# EAGLE design MovingHeadV2 (EAGLE 9.0.1)
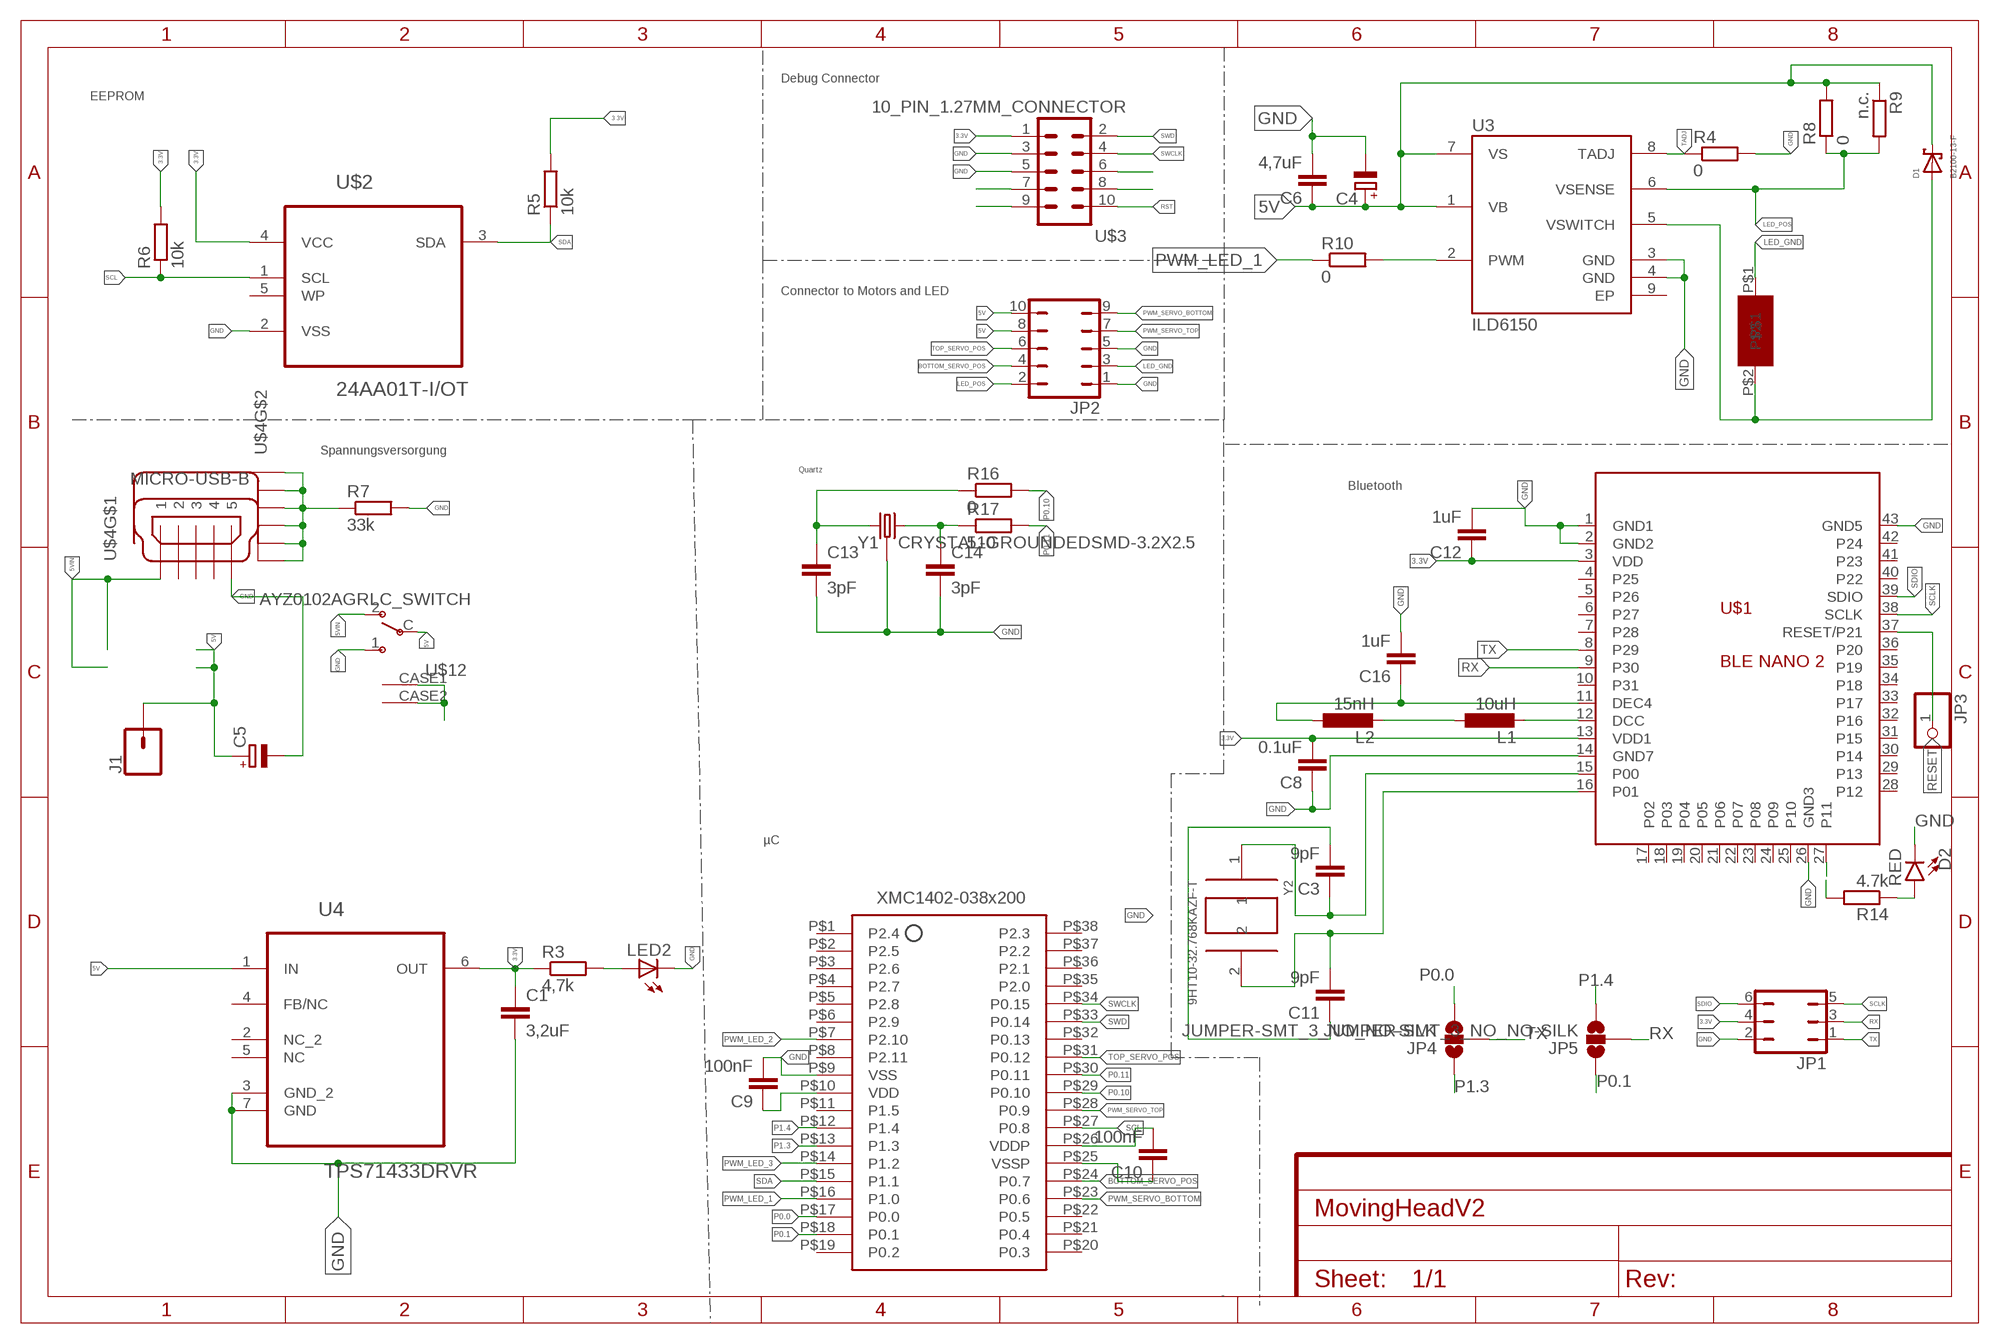
[diagram p0: schematic, sheet 1]

## Parts
C1  3,2uF  C-EUC0805  [C0805]
C3  9pF  C-EUC0805  [C0805]
C4  CPOL-EUD  [PANASONIC_D]
C5  CPOL-EUB/3528-21R  [B/3528-21R]
C6  4,7uF  C-EUC0805  [C0805]
C8  0.1uF  C-EUC0805  [C0805]
C9  100nF  C-EUC0805  [C0805]
C10  100nF  C-EUC0805  [C0805]
C11  9pF  C-EUC0805  [C0805]
C12  1uF  C-EUC0603  [C0603]
C13  3pF  C-EUC0805  [C0805]
C14  3pF  C-EUC0805  [C0805]
C16  1uF  C-EUC0603  [C0603]
D1  B2100-13-F  B220  [SMB]
D2  RED  LED-RED0603  [LED-0603]
J1  CONN_01  [1X01]
JP1  JP3Q  [JP3Q]
JP2  JP5Q  [JP5Q]
JP3  PINHD-1X1  [1X01]
JP4  JUMPER-SMT_3_NO_NO-SILK  [SMT-JUMPER_3_NO_NO-SILK]
JP5  JUMPER-SMT_3_NO_NO-SILK  [SMT-JUMPER_3_NO_NO-SILK]
L1  10uH  L-EUL2012C  [L2012C]
L2  15nH  L-EUL2012C  [L2012C]
LED2  LEDCHIPLED_0805  [CHIPLED_0805]
R3  4,7k  R-EU_R0805  [R0805]
R4  0  R-EU_R0805  [R0805]
R5  10k  R-EU_R0805  [R0805]
R6  10k  R-EU_R0805  [R0805]
R7  33k  R-EU_R0805  [R0805]
R8  0  R-EU_R0805  [R0805]
R9  n.c.  R-EU_R0805  [R0805]
R10  0  R-EU_R0805  [R0805]
R14  4.7k  R-EU_R0805  [R0805]
R16  0  R-EU_R0805  [R0805]
R17  510  R-EU_R0805  [R0805]
U3  ILD6150  [SOIC127P600X170-9N-V2]
U4  TPS71433DRVR  [SON65P200X200X80-7N]
U$1  BLE NANO 2  RBT07  [RBT07]
U$2  24AA01T-I/OT  [SOT95P270X145-5N]
U$3  10_PIN_1.27MM_CONNECTOR  [10_PIN_1.27MM]
U$4  MICRO-USB-B  [MICRO_USB_B]
U$7  CUSTOMCOIL6.8UH  [CUSTOMCOIL6.8UH]
U$10  XMC1400_38P  [XMC1400_38P]
U$12  AYZ0102AGRLC_SWITCH  [AYZ0102AGRLC]
Y1  CRYSTAL-GROUNDEDSMD-3.2X2.5  [CRYSTAL-SMD-3.2X2.5MM]
Y2  9HT10-32.768KAZF-T  [XTAL320X150X75]

## Nets
3.3V: C1.1 C8.2 C9.1 C10.2 C12.1 JP1.4 R3.1 R5.2 R6.2 U4.6(OUT) U$1.3(VDD) U$1.13(VDD1) U$2.4(VCC) U$3.1 U$10.P$10(VDD) U$10.P$26(VDDP)
5V: C4.+ C5.+ C6.1 D1.C J1.1 JP2.8 JP2.10 R8.2 R9.1 U3.1(VB) U3.7(VS) U4.1(IN) U$12.C
5VIN: U$4.1 U$12.2
BOTTOM_SERVO_POS: JP2.4 U$10.P$24(P0.7)
GND: C1.2 C3.2 C4.- C5.- C6.2 C8.1 C9.2 C10.1 C11.1 C12.2 C13.2 C14.2 C16.2 D2.C JP1.2 JP2.1 JP2.5 LED2.C R4.2 R7.2 U3.3(GND) U3.4(GND) U4.3(GND_2) U4.7(GND) U$1.1(GND1) U$1.2(GND2) U$1.14(GND7) U$1.26(GND3) U$1.43(GND5) U$2.2(VSS) U$3.3 U$3.5 U$4.5 U$10.P$9(VSS) U$10.P$25(VSSP) U$12.1 U$12.CASE1 U$12.CASE2 Y1.2 Y1.4
LED_GND: JP2.3 U$7.P$1
LED_POS: JP2.2 R8.1 R9.2 U3.6(VSENSE)
N$1: R10.2 U3.2(PWM)
N$2: D2.A R14.1
N$4: LED2.A R3.2
N$6: R7.1 U$4.P$1(S1) U$4.P$2(S2) U$4.P$6(S3) U$4.P$7(S4) U$4.P$9(S5) U$4.P$10(S6)
N$9: U$3.7
N$10: D1.A U3.5(VSWITCH) U$7.P$2
N$11: U$3.9
N$13: U$3.8
N$14: U$3.6
N$29: C14.1 R17.1 Y1.3
N$30: C13.1 R16.1 Y1.1
N$36: L1.2 U$1.12(DCC)
N$38: L1.1 L2.2
N$39: C16.1 L2.1 U$1.11(DEC4)
N$70: C3.1 U$1.15(P00) Y2.1
N$71: C11.2 U$1.16(P01) Y2.2
N$75: R14.2 U$1.27(P11)
P0.0: JP4.3 U$10.P$17(P0.0)
P0.1: JP5.1 U$10.P$18(P0.1)
P0.10: R16.2 U$10.P$29(P0.10)
P0.11: R17.2 U$10.P$30(P0.11)
P1.3: JP4.1 U$10.P$13(P1.3)
P1.4: JP5.3 U$10.P$12(P1.4)
PWM_LED_1: R10.1 U$10.P$16(P1.0)
PWM_LED_2: U$10.P$7(P2.10)
PWM_LED_3: U$10.P$14(P1.2)
PWM_SERVO_BOTTOM: JP2.9 U$10.P$23(P0.6)
PWM_SERVO_TOP: JP2.7 U$10.P$28(P0.9)
RESET: JP3.1 U$1.37(RESET/P21)
RST: U$3.10
RX: JP1.3 JP5.2 U$1.9(P30)
SCL: R6.1 U$2.1(SCL) U$10.P$27(P0.8)
SCLK: JP1.5 U$1.38(SCLK)
SDA: R5.1 U$2.3(SDA) U$10.P$15(P1.1)
SDIO: JP1.6 U$1.39(SDIO)
SWCLK: U$3.4 U$10.P$34(P0.15)
SWD: U$3.2 U$10.P$33(P0.14)
TADJ: R4.1 U3.8(TADJ)
TOP_SERVO_POS: JP2.6 U$10.P$31(P0.12)
TX: JP1.1 JP4.2 U$1.8(P29)
Unconnected: U4.2(NC_2) U4.4(FB/NC) U4.5(NC) U$1.4(P25) U$1.5(P26) U$1.6(P27) U$1.7(P28) U$1.10(P31) U$1.17(P02) U$1.18(P03) U$1.19(P04) U$1.20(P05) U$1.21(P06) U$1.22(P07) U$1.23(P08) U$1.24(P09) U$1.25(P10) U$1.28(P12) U$1.29(P13) U$1.30(P14) U$1.31(P15) U$1.32(P16) U$1.33(P17) U$1.34(P18) U$1.35(P19) U$1.36(P20) U$1.40(P22) U$1.41(P23) U$1.42(P24) U$2.5(WP) U$4.2 U$4.3 U$4.4 U$10.P$1(P2.4) U$10.P$2(P2.5) U$10.P$3(P2.6) U$10.P$4(P2.7) U$10.P$5(P2.8) U$10.P$6(P2.9) U$10.P$8(P2.11) U$10.P$11(P1.5) U$10.P$19(P0.2) U$10.P$20(P0.3) U$10.P$21(P0.4) U$10.P$22(P0.5) U$10.P$32(P0.13) U$10.P$35(P2.0) U$10.P$36(P2.1) U$10.P$37(P2.2) U$10.P$38(P2.3)

## Notes on the sheet
- Debug Connector
- EEPROM
- Connector to Motors and LED
- Spannungsversorgung
- Quartz
- Bluetooth
- µC

## Power pins joined to a net without a drawn wire
EP: U3.9(EP)

## Library data of the parts
C1 C6 C9 C10 = rcl:C-EU: CAPACITOR, European symbol; SPICEPREFIX: C
C3 C8 C11-C14 C16 = rcl:C-EU: CAPACITOR, European symbol
C4 C5 = rcl:CPOL-EU: POLARIZED CAPACITOR, European symbol; SPICEPREFIX: C
D1 = Schottky:B2*: Schottky Diode; DISTRIBUTOR: Diverse; DISTRIBUTOR_PART_NUMBER: *; MANUFACTURER_1: Diodes; MANUFACTURER_1_PART_NUMBER: B220-13-F; MANUFACTURER_2: Diverse; MANUFACTURER_2_PART_NUMBER: Diverse; MANUFACTURER_3: Diverse; MANUFACTURER_3_PART_NUMBER: Diverse; PACKAGE: *; PARTTYPE: *; PRICE_1K: *; PRICE_SAMPLE: *; SMD_PTH: SMD; SPANNUNG_STROM: 20V/2A; TOLERANCE: *
D2 = SparkFun-LED:LED-RED: Red SMD LED Used in manufacturing of most products at SparkFun Packages: 0603 - SMD 0603 package [Product Link] <http://docs.avagotech.com/docs/AV02-0551EN> 0603 SMART - SMD 0603 SMART package ( more efficient and expensive)[Product Link] <http://www.osram-os.com/Graphics/XPic2/00077099_0.pdf> 1206 - SMD1206 package [Product Link] <https://www.sparkfun.com/datasheets/DevTools/LilyPad/Q150OVS4.pdff> SparkFun Products: Pro Mini 328 -5V <https://www.sparkfun.com/products/821> RedBoard <https://www.sparkfun.com/products/12757> IOIO-OTG <https://www.sparkfun.com/products/13613>; PROD_ID: DIO-00819
J1 = SparkFun-Connectors:CONN_01: Single connection point. Often used as Generic Header-pin footprint for 0.1 inch spaced/style header connections On any of the 0.1 inch spaced packages, you can populate with these: Break Away Headers - Straight <https://www.sparkfun.com/products/116> (PRT-00116) Break Away Male Headers - Right Angle <https://www.sparkfun.com/products/553> (PRT-00553) Female Headers <https://www.sparkfun.com/products/115> (PRT-00115) Break Away Headers - Machine Pin <https://www.sparkfun.com/products/117> (PRT-00117) Break Away Female Headers - Swiss Machine Pin <https://www.sparkfun.com/products/743> (PRT-00743) This device is also useful as a general connection point to wire up your design to another part of your project. Our various solder wires solder well into these plated through hole pads. Hook-Up Wire - Assortment (Stranded, 22 AWG) <https://www.sparkfun.com/products/11375> (PRT-11375) Hook-Up Wire - Assortment (Solid Core, 22 AWG) <https://www.sparkfun.com/products/11367> (PRT-11367) View the entire wire category on our website here <https://www.sparkfun.com/categories/141> Special notes: SMTSO-256-ET is a "flush mount" nut for a 4-40 screw. We mostly use this on specialty testbeds; it is a nice way to connect hardware to your PCB at an adjustable hieght. Also note, the SNAP packages are for using a snappable style connector. We sell a baggie of snaps and they are also used on two LilyPad designs: Snap Assortment - 30 pack (male and female) <https://www.sparkfun.com/products/11347> (DEV-11347) LilyPad Arduino SimpleSnap <https://www.sparkfun.com/products/10941> (DEV-10941) LilyPad SimpleSnap Protoboard <https://www.sparkfun.com/products/10940> (DEV-10940)
JP1 = jumper:JP3Q: JUMPER
JP2 = jumper:JP5Q: JUMPER
JP3 = pinhead:PINHD-1X1: PIN HEADER
JP4 JP5 = SparkFun-Jumpers:JUMPER-SMT_3_NO: Normally open jumper This jumper has three pads in close proximity to each other. Apply solder to close the connection(s).
L1 L2 = rcl:L-EU: INDUCTOR, European symbol
LED2 = led:LED: LED OSRAM: - CHIPLED LG R971, LG N971, LY N971, LG Q971, LY Q971, LO R971, LY R971 LH N974, LH R974 LS Q976, LO Q976, LY Q976 LO Q996 - Hyper CHIPLED LW Q18S LB Q993, LB Q99A, LB R99A - SideLED LS A670, LO A670, LY A670, LG A670, LP A670 LB A673, LV A673, LT A673, LW A673 LH A674 LY A675 LS A676, LA A676, LO A676, LY A676, LW A676 LS A679, LY A679, LG A679 - Hyper Micro SIDELED® LS Y876, LA Y876, LO Y876, LY Y876 LT Y87S - SmartLED LW L88C, LW L88S LB L89C, LB L89S, LG L890 LS L89K, LO L89K, LY L89K LS L896, LA L896, LO L896, LY L896 - TOPLED LS T670, LO T670, LY T670, LG T670, LP T670 LSG T670, LSP T670, LSY T670, LOP T670, LYG T670 LG T671, LOG T671, LSG T671 LB T673, LV T673, LT T673, LW T673 LH T674 LS T676, LA T676, LO T676, LY T676, LB T676, LH T676, LSB T676, LW T676 LB T67C, LV T67C, LT T67C, LS T67K, LO T67K, LY T67K, LW E67C LS E67B, LA E67B, LO E67B, LY E67B, LB E67C, LV E67C, LT E67C LW T67C LS T679, LY T679, LG T679 LS T770, LO T770, LY T770, LG T770, LP T770 LB T773, LV T773, LT T773, LW T773 LH T774 LS E675, LA E675, LY E675, LS T675 LS T776, LA T776, LO T776, LY T776, LB T776 LHGB T686 LT T68C, LB T68C - Hyper Mini TOPLED® LB M676 - Mini TOPLED Santana® LG M470 LS M47K, LO M47K, LY M47K Source: http://www.osram.convergy.de LUXEON: - LUMILED® LXK2-PW12-R00, LXK2-PW12-S00, LXK2-PW14-U00, LXK2-PW14-V00 LXK2-PM12-R00, LXK2-PM12-S00, LXK2-PM14-U00 LXK2-PE12-Q00, LXK2-PE12-R00, LXK2-PE12-S00, LXK2-PE14-T00, LXK2-PE14-U00 LXK2-PB12-K00, LXK2-PB12-L00, LXK2-PB12-M00, LXK2-PB14-N00, LXK2-PB14-P00, LXK2-PB14-Q00 LXK2-PR12-L00, LXK2-PR12-M00, LXK2-PR14-Q00, LXK2-PR14-R00 LXK2-PD12-Q00, LXK2-PD12-R00, LXK2-PD12-S00 LXK2-PH12-R00, LXK2-PH12-S00 LXK2-PL12-P00, LXK2-PL12-Q00, LXK2-PL12-R00 Source: www.luxeon.com KINGBRIGHT: KA-3528ASYC Source: www.kingbright.com
R3-R10 = rcl:R-EU_: RESISTOR, European symbol; SPICEPREFIX: R
R14 R16 R17 = rcl:R-EU_: RESISTOR, European symbol
U3 = 1_MynewBib:ILD6150: ILD6150 LED Driver IC for High Power LEDs, 60V/1.5A High Efficiency Step-Down LED Driver IC SOIC127P600X170-9N-V2
U4 = 1_MynewBib:TPS71433DRVR: LOW-DROPOUT LINEAR REGULATOR; AVAILABILITY: Good; DESCRIPTION: 80mA, 10V, Quiescent Current 3.0?A, LDO Linear Regulator in SC70 or SON2x2 6-WSON -40 to 125; MF: Texas Instruments; MP: TPS71433DRVR; PACKAGE: SON-6 Texas Instruments; PRICE: 0.41 USD
U$1 = 1RedBeard:RBT07
U$2 = Microchip_By_element14_Batch_1:24AA01T-I/OT: EEPROM; DESCRIPTION: Serial EEPROM; MPN: 24AA01T-I/OT; OC_FARNELL: 1331269; OC_NEWARK: 72C4376; PACKAGE: SOT-5; SUPPLIER: Microchip
U$3 = own-connectors:10_PIN_1.27MM_CONNECTOR: Board-toBoard-Steckverbinder, 1.27MM Rastermaß Hersteller: Amphenol z.B.: Modell 20021111-00010T4LF von FCI
U$4 = own-connectors:MICRO-USB-B: Molex Micro Usb TYP-B Buchse, 5polig Produkt: MOLEX 105017-0001, Farnell Link: http://www.molex.com/molex/products/datasheet.jsp?part=active/1050170001_IO_CONNECTORS.xml&channel=Products&Lang=en-US
U$7 = 1_MynewBib:CUSTOMCOIL6.8UH
U$10 = 1_MynewBib:XMC1400_38P
U$12 = own-poti-switches:AYZ0102AGRLC_SWITCH: AYZ0102AGLC SPDT Switch On-On, Small, 100mA, 12V Supplier: C&K Components Sale: Farnell
Y1 = SparkFun-Clocks:CRYSTAL-GROUNDED: Crystals w/ Ground Pin (Generic) These are passive quartz crystals, which can be used as a clock source for a microcontroller. Crystal's are usually two-terminal devices. A third terminal may be optionally connected to ground, as recommended by the manufaturer.
Y2 = 9HT10-32.768KAZF-T:9HT10-32.768KAZF-T: Crystal, 32.768khz, 12.5pf, 3.2 x 1.5mm

## Board
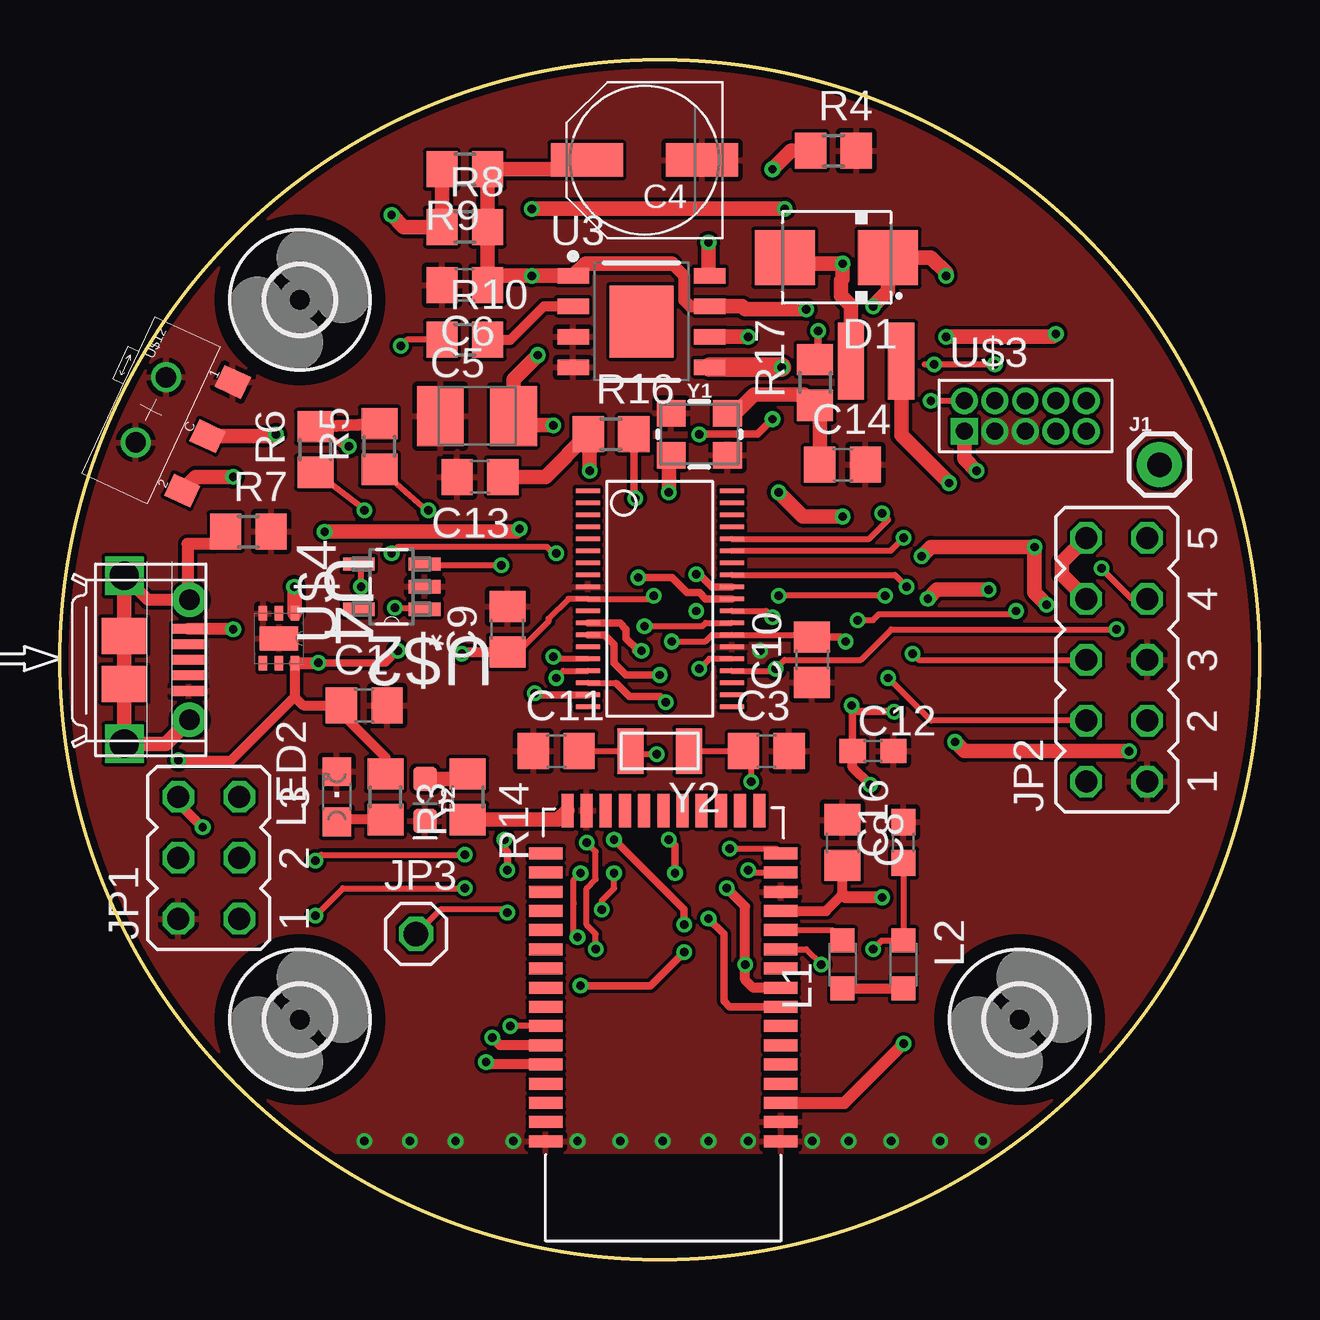
[diagram p1: board, top side]
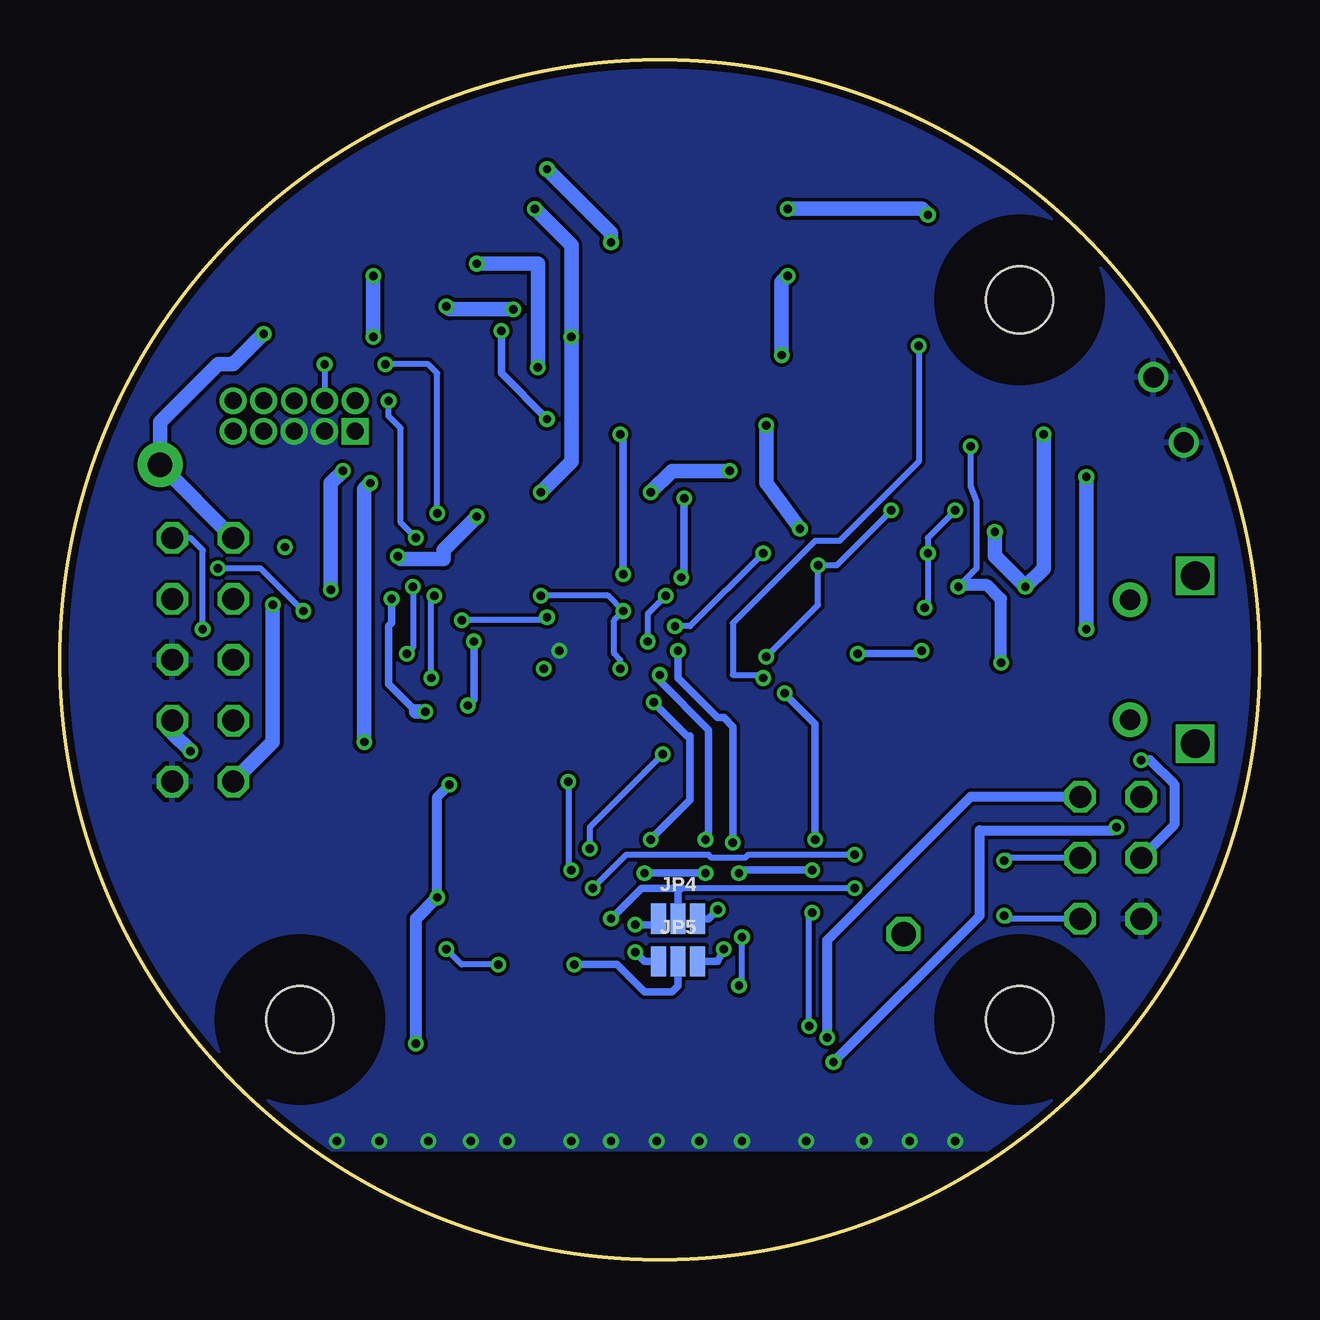
[diagram p2: board, bottom side, seen from below]

Size 50 x 50 mm. Coordinates in mm from the lower left corner, seen from the top.
Outline: circle at 25,25 radius 25
Copper layers (1*16): Top 0.035mm / dielectric 1.5mm / Bottom 0.035mm
Design rules "PCB-POOL Standard *": minimum track width 0.15mm, minimum drill 0.3mm, track to track 0.15mm, track to pad 0.15mm, pad to pad 0.15mm, via to via 0.15mm, smd to smd 0.15mm, copper to edge 0.3mm, drill to drill 0.2mm, minimum pad ring 0.2mm, minimum via ring 0.15mm, stop-mask expansion 0.075mm, vias tented up to drill 0.35mm, thermal gap 0.2mm
tRestrict: area 10.8,-6.5 to 39.5,4.2
bRestrict: area 10.5,-6.5 to 39.2,4.3

### Footprints (pad centres in the part's own frame; a part is rotated, then mirrored left to right if it is on the bottom)
C0805 = smd 1.3 x 1.5: 1 -0.95,0; 2 0.95,0
PANASONIC_D = smd 3 x 1.4: + 2.4,0; - -2.4,0
B/3528-21R = smd 1.95 x 2.5: + 1.525,0; - -1.525,0
C0603 = smd 1.1 x 1: 1 -0.85,0; 2 0.85,0
SMB = smd 2.5 x 2.3: A 2.15,0; C -2.15,0
LED-0603 = smd 1 x 1: A -0.877,0; C 0.877,0
1X01 = drill 1.016 pad 1.88: 1 0,0
JP3Q = drill 0.914 octagon: 1 -2.54,-1.27; 2 -2.54,1.27; 3 0,-1.27; 4 0,1.27; 5 2.54,-1.27; 6 2.54,1.27
JP5Q = drill 0.914 octagon: 1 -5.08,-1.27; 2 -5.08,1.27; 3 -2.54,-1.27; 4 -2.54,1.27; 5 0,-1.27; 6 0,1.27; 7 2.54,-1.27; 8 2.54,1.27; 9 5.08,-1.27; 10 5.08,1.27
1X01' = drill 1.016 octagon: 1 0,0
SMT-JUMPER_3_NO_NO-SILK = smd 0.635 x 1.27: 1 -0.813,0; 2 0,0; 3 0.813,0
L2012C = smd 1 x 1: 1 -1,0; 2 1,0
CHIPLED_0805 = smd 1.2 x 1.2: A 0,-1.05; C 0,1.05
R0805 = smd 1.3 x 1.5: 1 -0.95,0; 2 0.95,0
SOIC127P600X170-9N-V2 = smd 1.31 x 0.65: 1 -2.845,1.905; 2 -2.845,0.635; 3 -2.845,-0.635; 4 -2.845,-1.905; 5 2.845,-1.905; 6 2.845,-0.635; 7 2.845,0.635; 8 2.845,1.905 | smd 2.65 x 3: 9 0,0
SON65P200X200X80-7N = smd 0.61 x 0.356: 1 -1.041,0.66; 2 -1.041,0; 3 -1.041,-0.66; 4 1.041,-0.66; 5 1.041,0; 6 1.041,0.66 | smd 0.991 x 1.6: 7 0,0
RBT07 = smd 1.4 x 0.5: 1 -0.649,13.085; 2 -0.649,12.285; 3 -0.649,11.485; 4 -0.649,10.685; 5 -0.649,9.885; 6 -0.649,9.085; 7 -0.649,8.285; 8 -0.649,7.485; 9 -0.649,6.685; 10 -0.649,5.885; 11 -0.649,5.085; 12 -0.649,4.285; 13 -0.649,3.485; 14 -0.649,2.685; 15 -0.649,1.885; 16 -0.649,1.085; 28 9.151,1.085; 29 9.151,1.885; 30 9.151,2.685; 31 9.151,3.485; 32 9.151,4.285; 33 9.151,5.085; 34 9.151,5.885; 35 9.151,6.685; 36 9.151,7.485; 37 9.151,8.285; 38 9.151,9.085; 39 9.151,9.885; 40 9.151,10.685; 41 9.151,11.485; 42 9.151,12.285; 43 9.151,13.085 | smd 0.5 x 1.4: 17 0.251,-0.7; 18 1.051,-0.7; 19 1.851,-0.7; 20 2.651,-0.7; 21 3.451,-0.7; 22 4.251,-0.7; 23 5.051,-0.7; 24 5.851,-0.7; 25 6.651,-0.7; 26 7.451,-0.7; 27 8.251,-0.7
SOT95P270X145-5N = smd 1.321 x 0.559: 1 -1.372,0.94; 2 -1.372,0; 3 -1.372,-0.94; 4 1.372,-0.94; 5 1.372,0.94
10_PIN_1.27MM = drill 0.71 pad 0.889 square: 1 -2.54,-0.635 | drill 0.71 pad 0.889: 2 -2.54,0.635; 3 -1.27,-0.635; 4 -1.27,0.635; 5 0,-0.635; 7 1.27,-0.635; 8 1.27,0.635; 9 2.54,-0.635; 10 2.54,0.635 | drill 0.7 pad 0.889: 6 0,0.635
MICRO_USB_B = smd 1.35 x 0.4: 1 0.68,1.3; 2 0.68,0.65; 3 0.68,0; 4 0.68,-0.65; 5 0.68,-1.3 | drill 1.2 pad 1.5 square: P$1 -2,3.5; P$2 -2,-3.5 | smd 1.9 x 1.5: P$6 -2,-1; P$7 -2,1 | drill 0.85 pad 1.45: P$9 0.72,2.5; P$10 0.72,-2.5
2,8 = hole 2.8: 0,0
CUSTOMCOIL6.8UH = smd 1.1 x 3.2: P$1 -1.05,0; P$2 1.05,0
XMC1400_38P = smd 1 x 0.2: P$1 -3,4.5; P$2 -3,4; P$3 -3,3.5; P$4 -3,3; P$5 -3,2.5; P$6 -3,2; P$7 -3,1.5; P$8 -3,1; P$9 -3,0.5; P$10 -3,0; P$11 -3,-0.5; P$12 -3,-1; P$13 -3,-1.5; P$14 -3,-2; P$15 -3,-2.5; P$16 -3,-3; P$17 -3,-3.5; P$18 -3,-4; P$19 -3,-4.5; P$20 3,-4.5; P$21 3,-4; P$22 3,-3.5; P$23 3,-3; P$24 3,-2.5; P$25 3,-2; P$26 3,-1.5; P$27 3,-1; P$28 3,-0.5; P$29 3,0; P$30 3,0.5; P$31 3,1; P$32 3,1.5; P$33 3,2; P$34 3,2.5; P$35 3,3; P$36 3,3.5; P$37 3,4; P$38 3,4.5
AYZ0102AGRLC = smd 1 x 1.2: 1 -2.5,2.6; 2 2.5,2.6; C 0,2.6 | drill 0.85 pad 1: CASE1 -1.5,0; CASE2 1.5,0
CRYSTAL-SMD-3.2X2.5MM = smd 1.2 x 1.1: 1 -1.175,-0.875; 2 1.175,-0.875; 3 1.175,0.875; 4 -1.175,0.875
XTAL320X150X75 = smd 1.092 x 1.905: 1 -1.219,0; 2 1.219,0

### Placement (x,y rotation side)
C1  12.68,23.09 0 top
C3  29.45,21.19 0 top
C4  24.36,45.83 180 top
C5  17.38,35.16 0 top
C6  16.87,40.62 180 top
C8  32.62,17.38 270 top
C9  18.65,26.27 90 top
C10  31.35,25 90 top
C11  20.68,21.19 0 top
C12  33.89,21.19 0 top
C13  17.51,32.62 180 top
C14  32.62,33.13 0 top
C16  35.16,17.38 90 top
D1  32.37,41.76 180 top
D2  15.22,19.16 270 top
J1  45.83,33.13 0 top
JP1  6.2,16.74 90 top
JP2  44.05,25 90 top
JP3  [1X01']  14.84,13.57 0 top
JP4  24.24,14.21 0 bottom
JP5  24.24,12.43 0 bottom
L1  32.62,12.3 90 top
L2  35.16,12.3 270 top
LED2  11.54,19.29 0 top
R3  13.57,19.29 270 top
R4  32.24,46.21 0 top
R5  13.32,33.89 90 top
R6  10.65,33.76 90 top
R7  7.86,30.33 0 top
R8  16.87,43.03 0 top
R9  16.87,45.45 180 top
R10  16.87,38.34 0 top
R14  17,19.29 270 top
R16  22.97,34.4 0 top
R17  31.48,36.56 90 top
U3  24.24,39.1 0 top
U4  9.12,25.89 270 top
U$1  29.4,18.02 180 top
U$2  13.82,28.05 180 top
U$3  40.24,35.16 0 top
U$4  4.68,25 0 top
U$5  [2,8]  10,40 0 top
U$6  [2,8]  40,10 0 top
U$7  34.02,37.45 180 top
U$8  [2,8]  10,10 0 top
U$10  25,27.54 0 top
U$12  3.79,35.41 245 top
Y1  26.65,34.4 0 top
Y2  25,21.19 180 top

### Tracks (layer width: path | path; a pad name or v marks a point on that pad's centre or on a via)
3.3V  (via drill 0.35)
  Top 0.254: 19.1,25.32 20.36,26.59 20.36,26.71 21.19,27.54 U$10.P$10 24.62,27.54 v24.75,27.67 | 31.26,26.04 U$10.P$26 27.18,26.04 26.91,25.76 v25.51,25.76 | R6.2 11.85,33.89 v12.05,33.89 | v12.55,28.05 12.55,28.89 U$2.4
  Top 0.305: v34.78,22.84 33.26,22.84 v33,23.09 | v32.75,25.76 32.56,25.95 C10.2 | C12.1 33.04,23.06 | v10.78,24.87 13.57,24.87 v14.08,25.38
  Top 0.406: U4.6 9.79,23.45 | 11.41,23.09 10.14,23.09 9.79,23.45 | 11.41,23.09 C1.1 | 19.1,25.32 C9.1 16.81,25.32 v16.74,25.25 | 31.26,26.04 C10.2 | 13.19,20.62 R3.1 13.57,20.94 11.41,23.09 | v4.93,20.81 7.14,20.81 9.79,23.45 | U$1.13 31.93,14.53 32.62,15.22 C8.2 | v33.76,19.79 33.04,20.52 C12.1
  Top 0.508: R6.2 R5.2 | U4.6 9.81,24.87 v10.78,24.87 | 33.04,23.06 v33,23.09 | U$1.3 32.69,6.53 v35.16,9 | v34.27,15.09 32.75,15.09 32.62,15.22
  Top 0.61: U$3.1 37.7,33.38 v38.21,32.87 | v38.72,27.92 36.56,27.92 v36.18,27.54
  Bottom 0.254: v12.05,33.89 12.05,32.24 11.79,31.6 11.79,28.81 12.49,28.11 v12.55,28.05 | v24.75,27.67 25.51,26.91 v25.51,25.76
  Bottom 0.305: v36.18,27.54 36.18,26.52 36.3,26.4 36.3,23.98 35.16,22.84 | v33,23.09 32.75,23.35 v32.75,25.76 | v14.08,25.38 14.21,25.25 v16.74,25.25
  Bottom 0.406: JP1.4 3.54,18.14 3.54,19.79 4.55,20.81 v4.93,20.81 | v34.27,15.09 34.27,19.29 v33.76,19.79
  Bottom 0.508: v10.78,24.87 10.78,27.54 11.35,28.11 12.49,28.11 | v35.16,9 35.16,14.21 v34.27,15.09
  Bottom 0.61: v38.21,32.87 38.72,32.37 v38.72,27.92 | 35.16,22.84 v34.78,22.84
5V  (via drill 0.35)
  Top 0.406: 8.91,34.31 v9,34.4 | v9.76,28.05 9.79,28.02 | 19.03,30.33 v19.16,30.46 | 19.29,34.78 C5.+
  Top 0.508: 25.51,41.51 26.02,41 26.02,39.99 26.27,39.73 U3.7
  Top 0.61: U$12.C 8.91,34.31 | 9.79,28.02 U4.1 | v11.03,30.33 19.03,30.33 | v20.55,34.78 19.29,34.78 | C4.+ 21.58,45.45 R9.1 R8.2 C6.1 18.2,41 v19.67,41 U3.1 21.9,41.51 25.51,41.51 | C5.+ 18.91,36.69 v19.92,37.7 | v36.94,41 36.94,41.13 36.3,41.76 D1.C 34.52,40.36 v33.89,39.73 | v36.94,38.46 41.38,38.46 v41.51,38.59 | JP2.10 41.76,29.06 41.76,28.56 JP2.8 42.14,28.18 | U3.7 28.43,39.73 28.56,39.61 v31.1,39.61
  Bottom 0.61: v9,34.4 9,28.81 v9.76,28.05 11.03,29.32 v11.03,30.33 | v19.16,30.46 20.55,32.37 v20.55,34.78 | v19.92,37.7 19.92,40.75 v19.67,41 | v36.94,41 v36.94,38.46 | v41.51,38.59 42.78,37.32 43.41,37.32 45.83,34.91 J1.1 JP2.10 | v31.1,39.61 33.76,39.61 v33.89,39.73
5VIN  (via drill 0.35)
  Top 0.406: 7.19,26.3 v7.22,26.27
  Top 0.508: U$4.1 7.19,26.3
  Top 0.61: v7.22,32.62 5.66,32.62 U$12.2
  Bottom 0.61: v7.22,26.27 v7.22,32.62
BOTTOM_SERVO_POS  (via drill 0.35)
  Top 0.254: JP2.4 36.3,22.46 v34.52,24.24 | v34.4,27.67 v29.95,27.67 | v26.52,27.04 v26.52,27.03 | U$10.P$24 27.07,25.04 v26.65,24.62
  Bottom 0.254: v34.52,24.24 34.52,27.54 v34.4,27.67 | v29.95,27.67 27.16,27.67 v26.52,27.03 26.91,26.65 26.91,25.25 26.65,25 v26.65,24.62
GND  (via drill 0.35)
  other vias: 29.19,25.38 21.57,4.93 25.13,4.93 23.35,4.93 27.03,4.93 28.68,4.93 31.35,4.93 32.87,4.93 34.65,4.93 36.68,4.93 38.46,4.93 18.9,4.93 16.49,4.93 14.59,4.93 12.68,4.93
  pour Bottom: -4.21,54.21 -4.21,-4.21 56.75,-4.21 56.75,55.48 -4.21,55.48
  pour Top: -2.94,-2.94 -2.94,54.21 55.48,54.21 55.48,-2.94
LED_GND  (via drill 0.35)
  Top 0.61: v44.56,21.19 37.7,21.19 v37.32,21.57 | v37.06,32.37 35.07,34.36 U$7.P$1
  Bottom 0.61: JP2.3 45.32,21.95 v44.56,21.19 | v37.32,21.57 37.32,32.11 v37.06,32.37
LED_POS  (via drill 0.35)
  Top 0.61: R9.2 R8.1 14.33,43.03 v13.82,43.54 | U3.6 v28.68,38.46 | v29.95,31.98 30.97,30.97 v32.62,30.97 | v35.92,29.32 36.3,29.7 v40.62,29.7 40.62,27.79 v41.13,27.29 | v30.21,43.8 v19.67,43.8
  Top 0.813: JP2.2 42.65,19.79
  Bottom 0.61: v29.95,31.98 28.68,33.26 v28.68,38.46 28.68,42.27 v30.21,43.8 | v32.62,30.97 34.02,29.57 34.02,29.19 35.8,29.19 v35.92,29.32 | v41.13,27.29 41.13,21.57 JP2.2 | v19.67,43.8 14.08,43.8 v13.82,43.54
N$1
  Top 0.406: R10.2 18.78,38.34 20.17,39.73 U3.2
N$2
  Top 0.61: D2.A 16.8,20.04 R14.1
N$4
  Top 0.406: R3.2 11.64,18.34 LED2.A
N$6
  Top 0.508: U$4.P$1 3.68,27.5 U$4.P$9 5.32,27.59 5.32,29.83 6.4,29.83 R7.1
  Top 0.61: U$4.P$1 U$4.P$7 U$4.P$6 U$4.P$2 4.4,21.5 U$4.P$10
N$10  (via drill 0.35)
  Top 0.61: D1.A 30.47,41.51 v32.62,41.51 32.62,40.88 32.56,40.81 32.56,40.18 32.97,39.77 U$7.P$2
  Top 0.813: U3.5 v30.08,37.19
  Bottom 0.61: v32.62,41.51 30.08,41.51 v30.08,37.19
N$29
  Top 0.61: C14.1 31.67,35.41 R17.1 31.04,36.05 28.94,36.05 28.16,35.27 Y1.3
N$30  (via drill 0.35)
  Top 0.61: C13.1 20.24,32.62 R16.1 22.08,34.34 v22.08,32.87 | Y1.1 25.38,33.43 v25.38,31.98
  Bottom 0.61: v25.38,31.98 24.49,32.87 v22.08,32.87
N$36
  Top 0.254: U$1.12 32.19,13.73 L1.2
N$38
  Top 0.406: L1.1 L2.2
N$39  (via drill 0.35)
  Top 0.254: U$1.11 31.1,12.93 v31.73,12.3 | v33.89,12.94 34.26,13.3 L2.1 C16.1
  Bottom 0.254: v31.73,12.3 33.26,12.3 v33.89,12.94
N$70  (via drill 0.35)
  Top 0.254: Y2.1 C3.1 28.81,20.88 v28.81,19.92 | v28.68,16.24 28.79,16.13 U$1.15
  Bottom 0.254: v28.81,19.92 28.81,16.36 v28.68,16.24
N$71  (via drill 0.35)
  Top 0.254: C11.2 Y2.2 23.91,21.06 v24.87,21.06 | v27.92,17.13 29.85,17.13 U$1.16
  Bottom 0.254: v24.87,21.06 27.92,18.02 v27.92,17.13
N$75
  Top 0.61: R14.2 20.77,18.34 U$1.27
P0.0  (via drill 0.35)
  Top 0.254: v22.59,14.59 22.59,14.97 23.09,15.47 v23.09,16.11 | U$10.P$17 23.17,24.04 23.22,23.98
  Top 0.305: v25.64,16.11 25.64,17.25 v25.38,17.51 | v25.25,23.22 25,23.48 23.73,23.48 23.22,23.98
  Bottom 0.305: JP4.3 22.97,14.21 v22.59,14.59 | v23.09,16.11 v25.64,16.11 | v25.38,17.51 23.73,19.16 23.73,21.82 23.86,21.82 v25.25,23.22
P0.1  (via drill 0.35)
  Top 0.254: v21.57,13.44 21.41,13.6 21.41,14.84 21.41,14.87 21.41,15.82 v21.7,16.11
  Top 0.305: v26.02,12.81 24.62,11.41 v21.7,11.41 | v19.79,23.6 19.86,23.54 U$10.P$18 | v18.52,17.51 18.52,17.13 18.65,17 v18.65,16.24
  Bottom 0.254: v21.7,11.41 21.57,11.54 v21.57,13.44
  Bottom 0.305: JP5.1 25.64,12.43 v26.02,12.81 | v19.79,23.6 18.52,22.33 v18.52,17.51 | v21.7,16.11 21.57,16.24 v18.65,16.24
P0.10  (via drill 0.35)
  Top 0.305: R16.2 23.92,31.8 v23.98,31.73 | v24.11,28.43 25.51,28.43 26.14,27.79 26.65,27.79 26.91,27.54 U$10.P$29
  Bottom 0.305: v23.98,31.73 23.98,28.56 v24.11,28.43
P0.11  (via drill 0.35)
  Top 0.305: U$10.P$30 27.17,28.04 26.65,28.56 v26.52,28.56 | v26.65,34.4 29.06,34.4 v29.7,35.03 | v31.6,38.72 31.6,37.63 R17.2
  Bottom 0.305: v26.52,28.56 26.52,34.27 v26.65,34.4 | v29.7,35.03 31.6,36.94 v31.6,38.72
P1.3  (via drill 0.35)
  Top 0.305: 22.44,26.04 U$10.P$13 22.69,26.04 23.09,25.64 23.09,24.87 23.6,24.36 v25,24.36 | v23.09,17.51 26.02,14.59 v26.02,13.95
  Bottom 0.305: v25,24.36 25,24.11 22.97,22.08 22.97,17.63 v23.09,17.51 | v26.02,13.95 25.3,13.95 JP4.1
P1.4  (via drill 0.35)
  Top 0.254: v22.33,12.94 22.33,13.57 21.95,13.95 21.95,15.47 22.33,15.86 22.33,17 v21.95,17.38
  Top 0.305: U$10.P$12 22.46,26.54 | 22.46,26.54 22.82,26.54 | 23.98,25.38 24.11,25.38 | 24.11,25.38 v24.24,25.38 | 22.46,26.54 22.48,26.52 23.35,26.52 23.6,26.27 23.6,25.89 24.11,25.38
  Bottom 0.305: JP5.3 22.59,12.43 v22.33,12.94 | v21.95,17.38 21.95,22.21 22.33,22.59 22.59,22.59 24.24,24.24 v24.24,25.38
PWM_LED_1  (via drill 0.35)
  Top 0.254: R10.1 14.46,38.34 v14.21,38.08 | v20.68,24.24 20.98,24.54 U$10.P$16
  Bottom 0.254: v14.21,38.08 14.21,33.26 17.51,29.95 18.52,29.95 21.95,26.52 21.95,24.36 20.81,24.36 v20.68,24.24
PWM_SERVO_BOTTOM  (via drill 0.35)
  Top 0.254: U$10.P$23 29.75,24.54 v29.83,24.62 30.21,25 33.38,25 34.65,26.27 v44.05,26.27
  Bottom 0.254: v44.05,26.27 44.05,29.57 44.56,30.08 JP2.9
PWM_SERVO_TOP  (via drill 0.35)
  Top 0.254: U$10.P$28 29.44,27.04 v29.7,26.78 | v43.41,28.81 44.69,27.54 JP2.7 | v33.26,26.65 33.89,26.65 34.14,26.91 39.73,26.91 v39.86,27.03
  Bottom 0.254: v29.7,26.78 29.83,26.65 v33.26,26.65 | v39.86,27.03 41.64,28.81 v43.41,28.81
RESET  (via drill 0.35)
  Top 0.254: 18.55,9.73 v18.78,9.73 U$1.37 | v18.65,14.46 18.52,14.59 15.86,14.59 JP3.1
  Bottom 0.254: v18.78,9.73 18.78,14.33 v18.65,14.46
RX  (via drill 0.35)
  Top 0.254: v10.65,16.62 10.9,16.87 v16.87,16.87
  Top 0.406: v27.79,15.47 28.56,14.71 v28.56,12.3 28.56,11.66 28.89,11.33 U$1.9
  Bottom 0.254: JP1.3 10.52,16.74 | v27.79,15.47 26.4,16.87 22.97,16.87 22.84,16.74 21.44,16.74 21.32,16.87 v16.87,16.87
  Bottom 0.305: JP5.2 24.24,11.41 24.49,11.16 25.64,11.16 26.78,12.3 v28.56,12.3
  Bottom 0.406: 10.52,16.74 v10.65,16.62
SCL  (via drill 0.35)
  Top 0.254: v20.68,29.45 20.55,29.45 20.3,29.7 14.08,29.7 v13.82,29.45 | v13.95,27.16 15.14,27.16 U$2.1 | v24.36,26.4 26.78,26.4 26.92,26.54 U$10.P$27 | R6.1 12.68,31.29 v12.68,31.22
  Bottom 0.254: v13.95,27.16 13.82,27.29 v13.82,29.45 13.82,30.08 v12.68,31.22 | v24.36,26.4 23.73,26.4 v20.68,29.45
SCLK  (via drill 0.35)
  Top 0.406: U$1.38 18.34,8.93 v18.02,9.25
  Bottom 0.406: JP1.5 12.05,19.29 18.02,13.32 v18.02,9.25
SDA  (via drill 0.35)
  Top 0.254: U$10.P$15 20.64,25.04 | v18.4,28.94 15.25,28.94 | R5.1 15.29,31.22 v15.35,31.22
  Top 0.406: 20.64,25.04 v20.55,25.13 | 15.25,28.94 U$2.3
  Bottom 0.254: v20.55,25.13 18.4,27.29 v18.4,28.94 17.63,28.94 v15.35,31.22
SDIO  (via drill 0.35)
  Top 0.406: U$1.39 17.87,8.13 v17.76,8.24 | v5.95,18.02 4.93,19.03 JP1.6
  Bottom 0.406: v17.76,8.24 11.66,14.33 11.66,17.89 6.08,17.89 v5.95,18.02
SWCLK  (via drill 0.35)
  Top 0.254: U$10.P$34 33.72,30.04 34.52,30.84 v34.27,31.1 | 36.05,37.32 v36.43,37.32 v38.97,37.32
  Bottom 0.254: v34.27,31.1 34.27,36.94 34.65,37.32 v36.43,37.32 | v38.97,37.32 U$3.4
SWD  (via drill 0.35)
  Top 0.254: v35.16,30.08 34.62,29.54 U$10.P$33 | v36.3,35.8 U$3.2
  Bottom 0.254: v35.16,30.08 35.8,30.71 35.8,34.65 36.3,35.16 v36.3,35.8
TADJ  (via drill 0.35)
  Top 0.61: R4.1 30.46,46.21 v29.7,45.45 | v27.03,42.4 27.03,41.05 U3.8
  Bottom 0.61: v29.7,45.45 27.03,42.78 v27.03,42.4
TOP_SERVO_POS  (via drill 0.35)
  Top 0.254: U$10.P$31 34.8,28.54 v35.29,28.05 | v35.54,25.25 35.8,25 JP2.6
  Bottom 0.254: v35.29,28.05 35.29,25.51 v35.54,25.25
TX  (via drill 0.35)
  Top 0.254: v10.65,14.33 11.79,15.47 v16.87,15.47
  Top 0.305: v27.03,14.21 27.67,13.57 27.67,10.78 27.91,10.53 U$1.8
  Top 0.406: v27.03,14.21 27.16,14.07
  Bottom 0.254: v16.87,15.47 24.11,15.47 | JP1.1 10.52,14.21
  Bottom 0.305: v27.03,14.21 25.76,15.47 24.11,15.47 24.24,15.35 JP4.2
  Bottom 0.406: 10.52,14.21 v10.65,14.33

### Text on the board
tValues: Bluetooth LE
tStop: 1 | Debug | 5V | Bluetooth | LED_P 0.7 0.12 5V 5V / GND LED_GND GND 0.9 0.6 | SDIO | SLCK | 1 | 3.3V | RX | TX | GND | Moving_Head_V2 | HW: Tobias Heigl / SW: Andreas Laubhahn